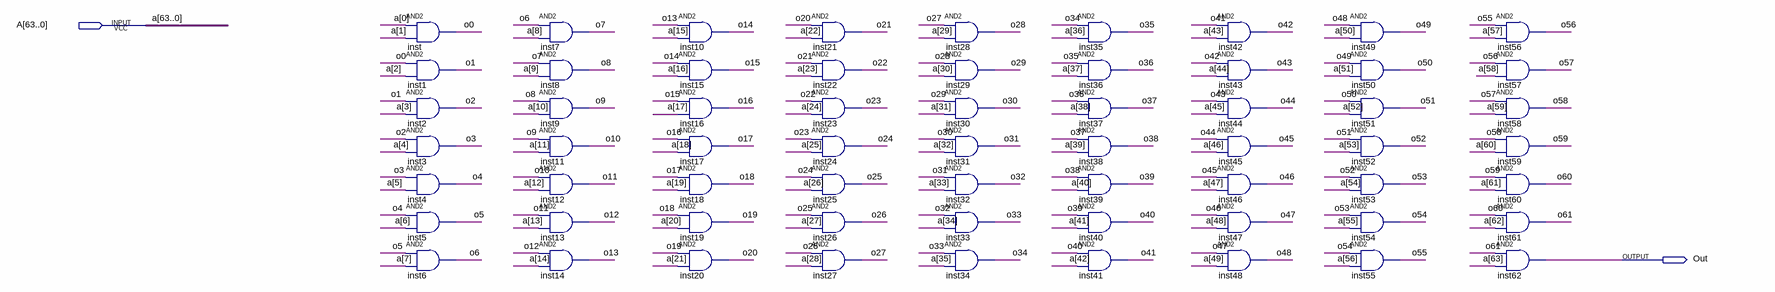
[diagram p0: schematic sheet]
// Quartus schematic and_self.bdf as structural Verilog: 63 symbols, 2 pins
module and_self (
  input  [63:0] A,
  output Out
);

  wire o0, o1, o2, o3, o4, o5, o6, o7, o8, o9, o10, o11, o12, o13, o14, o15, o16, o17, o18, o19, o20, o21,
       o22, o23, o24, o25, o26, o27, o28, o29, o30, o31, o32, o33, o34, o35, o36, o37, o38, o39, o40, o41,
       o42, o43, o44, o45, o46, o47, o48, o49, o50, o51, o52, o53, o54, o55, o56, o57, o58, o59, o60, o61;

  and inst (o0, A[0], A[1]);
  and inst1 (o1, o0, A[2]);
  and inst2 (o2, o1, A[3]);
  and inst3 (o3, o2, A[4]);
  and inst4 (o4, o3, A[5]);
  and inst5 (o5, o4, A[6]);
  and inst6 (o6, o5, A[7]);
  and inst7 (o7, o6, A[8]);
  and inst8 (o8, o7, A[9]);
  and inst9 (o9, o8, A[10]);
  and inst11 (o10, o9, A[11]);
  and inst12 (o11, o10, A[12]);
  and inst13 (o12, o11, A[13]);
  and inst14 (o13, o12, A[14]);
  and inst10 (o14, o13, A[15]);
  and inst15 (o15, o14, A[16]);
  and inst16 (o16, o15, A[17]);
  and inst17 (o17, o16, A[18]);
  and inst18 (o18, o17, A[19]);
  and inst19 (o19, o18, A[20]);
  and inst20 (o20, o19, A[21]);
  and inst21 (o21, o20, A[22]);
  and inst22 (o22, o21, A[23]);
  and inst23 (o23, o22, A[24]);
  and inst24 (o24, o23, A[25]);
  and inst25 (o25, o24, A[26]);
  and inst26 (o26, o25, A[27]);
  and inst27 (o27, o26, A[28]);
  and inst28 (o28, o27, A[29]);
  and inst29 (o29, o28, A[30]);
  and inst30 (o30, o29, A[31]);
  and inst31 (o31, o30, A[32]);
  and inst32 (o32, o31, A[33]);
  and inst33 (o33, o32, A[34]);
  and inst34 (o34, o33, A[35]);
  and inst35 (o35, o34, A[36]);
  and inst36 (o36, o35, A[37]);
  and inst37 (o37, o36, A[38]);
  and inst38 (o38, o37, A[39]);
  and inst39 (o39, o38, A[40]);
  and inst40 (o40, o39, A[41]);
  and inst41 (o41, o40, A[42]);
  and inst42 (o42, o41, A[43]);
  and inst43 (o43, o42, A[44]);
  and inst44 (o44, o43, A[45]);
  and inst45 (o45, o44, A[46]);
  and inst46 (o46, o45, A[47]);
  and inst47 (o47, o46, A[48]);
  and inst48 (o48, o47, A[49]);
  and inst49 (o49, o48, A[50]);
  and inst50 (o50, o49, A[51]);
  and inst51 (o51, o50, A[52]);
  and inst52 (o52, o51, A[53]);
  and inst53 (o53, o52, A[54]);
  and inst54 (o54, o53, A[55]);
  and inst55 (o55, o54, A[56]);
  and inst56 (o56, o55, A[57]);
  and inst57 (o57, o56, A[58]);
  and inst58 (o58, o57, A[59]);
  and inst59 (o59, o58, A[60]);
  and inst60 (o60, o59, A[61]);
  and inst61 (o61, o60, A[62]);
  and inst62 (Out, o61, A[63]);
endmodule
